# Altium schematic sheet GD_Power_Meter_1.SchDoc: TOP
size A3; PCB PN: PB10013; PCBA PN: PA00013
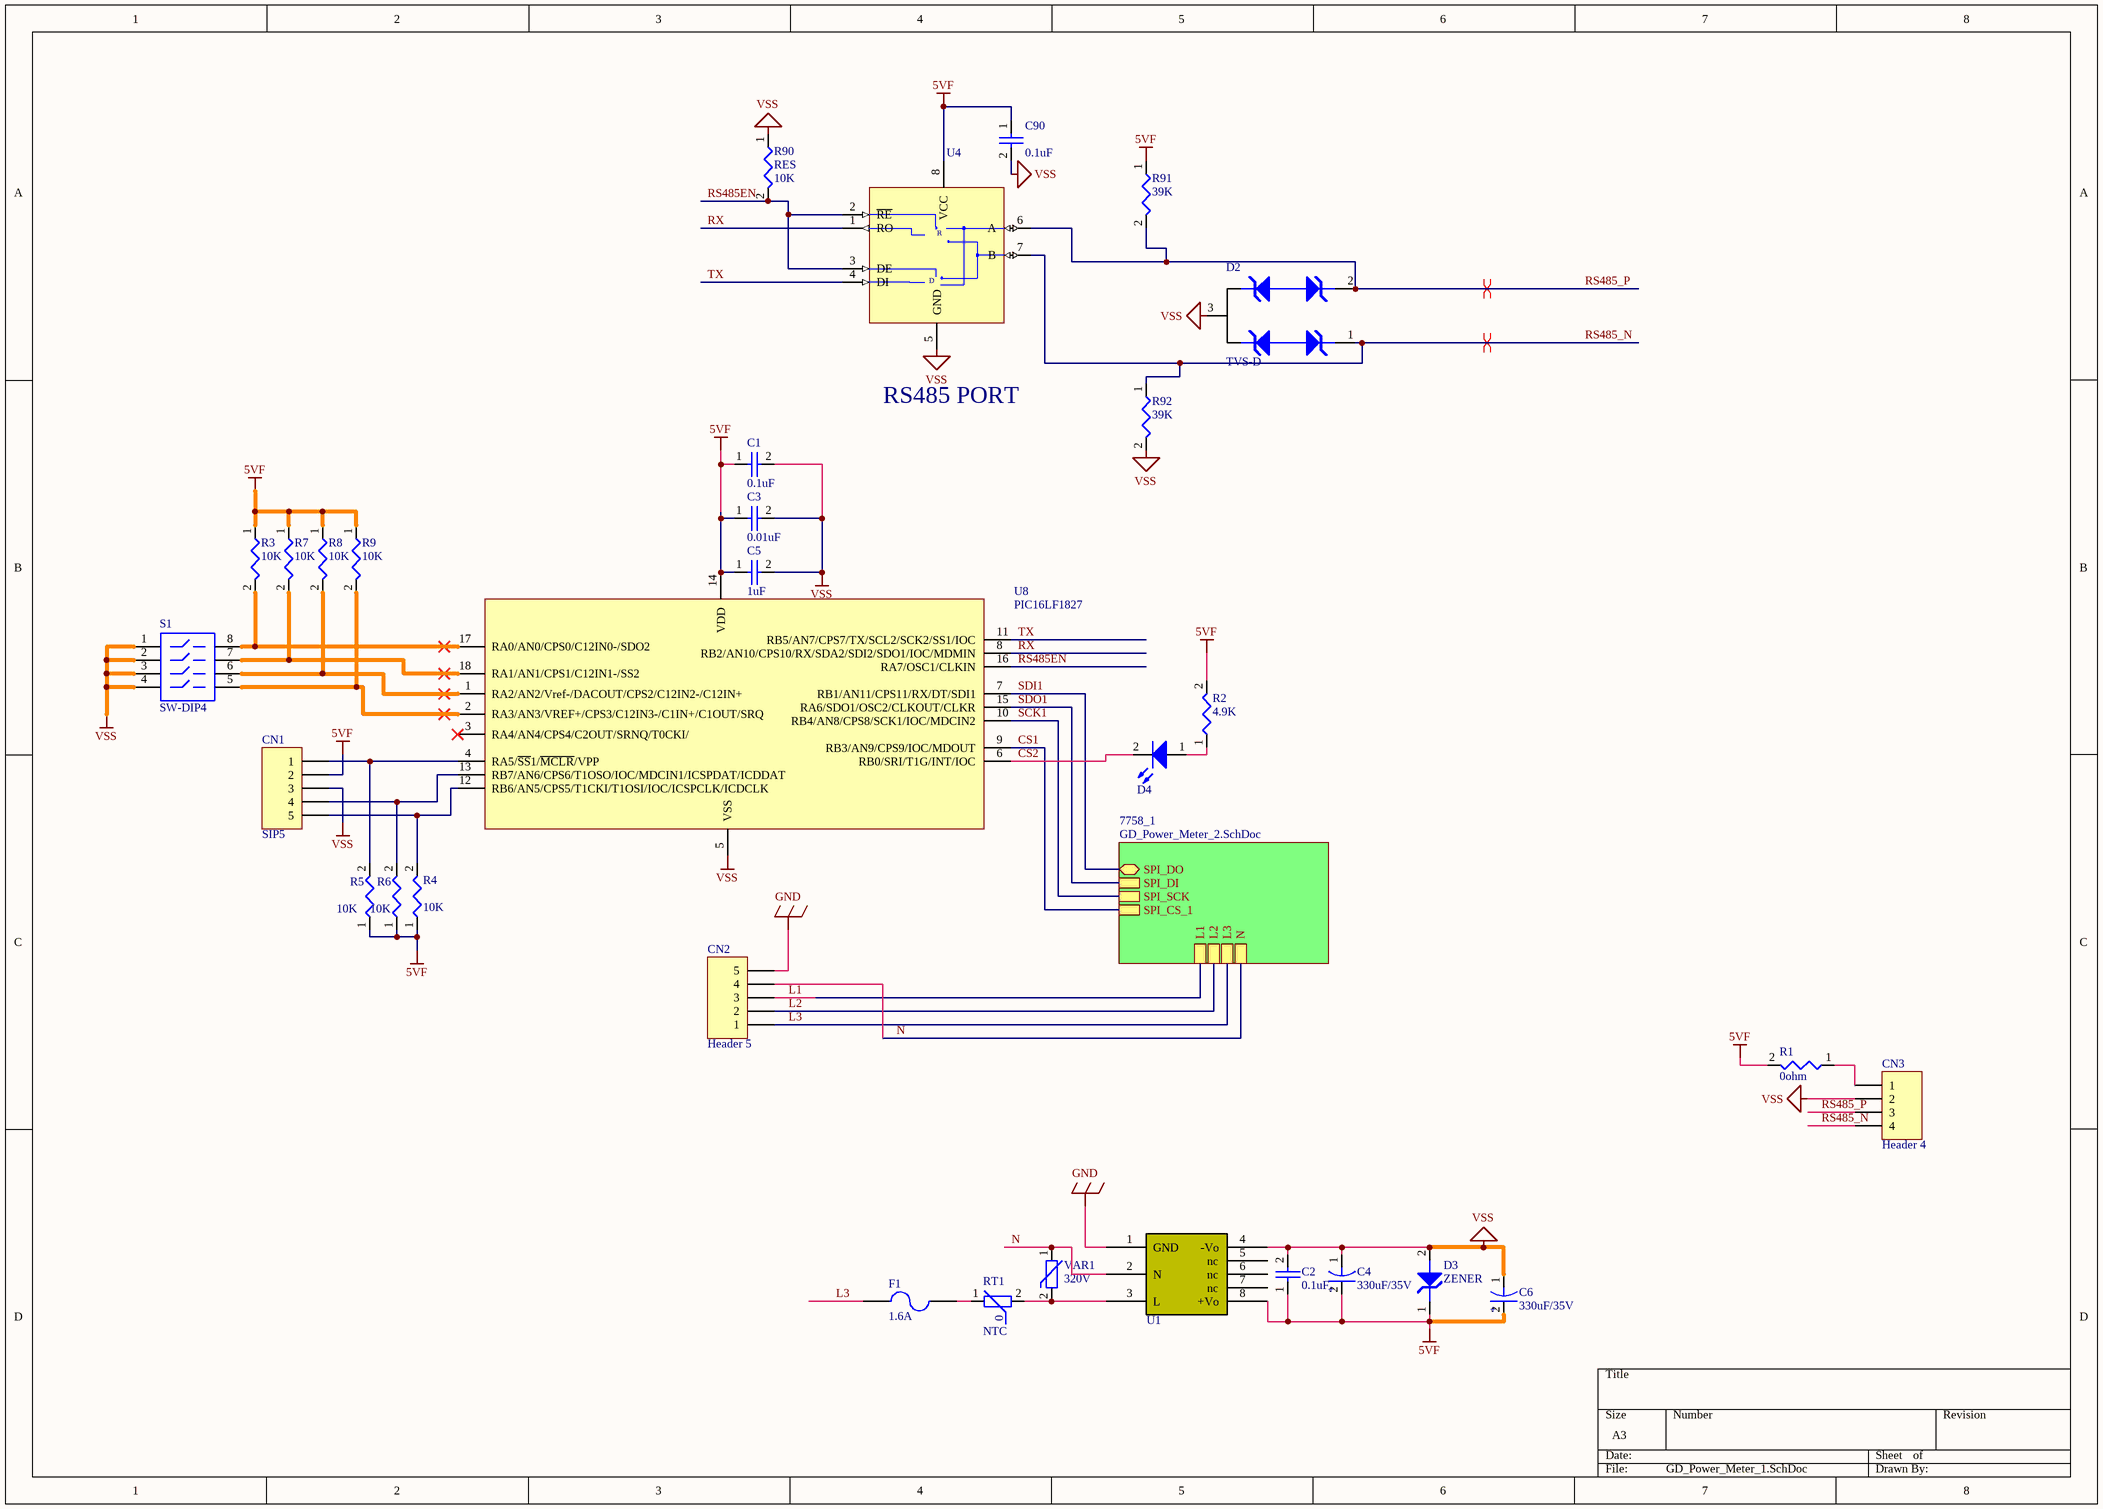
[diagram p0: GD_Power_Meter_1.SchDoc]

## Parts
C1  value 0.1uF  [C0805]  (hidden comment: CAP)
C2  value 0.1uF  [C0805]  (hidden comment: CAP)
C3  value 0.01uF  [C0805]  (hidden comment: CAP)
C4  value 330uF/35V  [CA10X16P5]  (hidden comment: CAPACITOR)
C5  value 1uF  [C0805]  (hidden comment: CAP)
C6  value 330uF/35V  [CA10X16P5]  (hidden comment: CAPACITOR)
C90  value 0.1uF  [C0805]  (hidden comment: CAP)
CN1  SIP5  [SIP5]  (no BOM)
CN2  Header 5  [KF7.62-5P]
CN3  Header 4  [HT5.08-4P-H]
D2  TVS-D  [SOT23-123]
D3  ZENER  [SMB]
D4  ED00056  [LED_DIP]  (value not drawn)
F1  value 1.6A  [392XXXX000]  (hidden comment: Fuse)
R1  value 0ohm  [R0805]  (hidden comment: RES)
R2  value 4.9K  [R0805]  (hidden comment: RES)
R3  value 10K  [R0603]  (hidden comment: RES)
R4  value 10K  [R0603]  (hidden comment: RES)
R5  value 10K  [R0603]  (hidden comment: RES)
R6  value 10K  [R0603]  (hidden comment: RES)
R7  value 10K  [R0603]  (hidden comment: RES)
R8  value 10K  [R0603]  (hidden comment: RES)
R9  value 10K  [R0603]  (hidden comment: RES)
R90  RES  value 10K  [R0603]
R91  value 39K  [R0805]  (hidden comment: RES)  (no BOM)
R92  value 39K  [R0805]  (hidden comment: RES)  (no BOM)
RT1  NTC  [NTC8_5x6P5]
S1  SW-DIP4  [SW_4P]
U1  LH05-10B05  [LH05X]  (value not drawn)
U4  SN65HVD11D  [SOIC8]  (value not drawn)
U8  PIC16LF1827  [SO18]
VAR1  value 320V  [VAR16_7X6_6P7_5]  (hidden comment: VARISTOR)

## Sub-sheets
7758_1 = GD_Power_Meter_2.SchDoc: L2, L3, L1, SPI_DI, SPI_DO (bidir), SPI_SCK, SPI_CS_1, N

## Nets
5VF: C1.1 C2.1 C3.1 C4.2 C5.1 C6.2 C90.1 CN1.2 D3.1 R1.2 R2.2 R3.1 R4.1 R5.1 R6.1 R7.1 R8.1 R9.1 R91.1 U1.8(+Vo) U4.8(VCC) U8.14(VDD)
GND: CN2.5 U1.1(GND)
VSS: C1.2 C2.2 C3.2 C4.1 C5.2 C6.1 C90.2 CN1.3 CN3.2 D2.3 D3.2 R90.1 R92.2 S1.1 S1.2 S1.3 S1.4 U1.4(-Vo) U4.5(GND) U8.5(VSS)
CS1: U8.9(RB3/AN9/CPS9/IOC/MDOUT) ; sheet 7758_1/SPI_CS_1
CS2: D4.2 U8.6(RB0/SRI/T1G/INT/IOC)
L1: CN2.3 ; sheet 7758_1/L1
L2: CN2.2 ; sheet 7758_1/L2
L3: CN2.1 F1.1 ; sheet 7758_1/L3
N: CN2.4 U1.2(N) VAR1.1 ; sheet 7758_1/N
RS485_N: CN3.4 D2.1 R92.1 U4.7(B)
RS485_P: CN3.3 D2.2 R91.2 U4.6(A)
RS485EN: R90.2 U4.2(~{RE}) U4.3(DE) U8.16(RA7/OSC1/CLKIN)
RX: U4.1(RO) U8.8(RB2/AN10/CPS10/RX/SDA2/SDI2/SDO1/IOC/MDMIN)
SCK1: U8.10(RB4/AN8/CPS8/SCK1/IOC/MDCIN2) ; sheet 7758_1/SPI_SCK
SDI1: U8.7(RB1/AN11/CPS11/RX/DT/SDI1) ; sheet 7758_1/SPI_DO
SDO1: U8.15(RA6/SDO1/OSC2/CLKOUT/CLKR) ; sheet 7758_1/SPI_DI
TX: U4.4(DI) U8.11(RB5/AN7/CPS7/TX/SCL2/SCK2/SS1/IOC)
NetCN1_1: CN1.1 R5.2 U8.4(RA5/~{SS}1/~{MCLR}/VPP)
NetCN1_4: CN1.4 R6.2 U8.13(RB7/AN6/CPS6/T1OSO/IOC/MDCIN1/ICSPDAT/ICDDAT)
NetCN1_5: CN1.5 R4.2 U8.12(RB6/AN5/CPS5/T1CKI/T1OSI/IOC/ICSPCLK/ICDCLK)
NetCN3_1: CN3.1 R1.1
NetD4_1: D4.1 R2.1
NetF1_2: F1.2 RT1.1
NetR3_2: R3.2 S1.8 U8.17(RA0/AN0/CPS0/C12IN0-/SDO2)
NetR7_2: R7.2 S1.7 U8.18(RA1/AN1/CPS1/C12IN1-/SS2)
NetR8_2: R8.2 S1.6 U8.1(RA2/AN2/Vref-/DACOUT/CPS2/C12IN2-/C12IN+)
NetR9_2: R9.2 S1.5 U8.2(RA3/AN3/VREF+/CPS3/C12IN3-/C1IN+/C1OUT/SRQ)
NetRT1_2: RT1.2 U1.3(L) VAR1.2

Not connected (* = marked no-connect by the designer): U1 5(nc) 6(nc) 7(nc); U8 3(RA4/AN4/CPS4/C2OUT/SRNQ/T0CKI/)*

## Layout directives
differential pair: RS485_N, RS485_P

## Notes on the sheet
- RS485 PORT
- (in symbol EC00095) +
- (in symbol EF00003) 0
- (in symbol EU00041) R; D

## Library data of the parts
C1 C2 C90 = EC00014: CAP SMD CR X7R 50V 10% 0.1uF 0805 ROHS; Manufacturer: YAGEO; Manufacturer P/N: CC0805KRX7R9BB104; ID: 14; HelpURL: *; P/N: EC00014
C3 = EC00018: CAP SMD CR X7R 50V 10% 10nF 0805 ROHS; Manufacturer: Murata; Manufacturer P/N: GRM216R71H103KA01D; ID: 18; HelpURL: *; P/N: EC00018
C4 C6 = EC00095: CAP 35V 20% 330uF 10X16X0.6MM ROHS，7000hours; Manufacturer: NIPPON CHEMI-CON; Manufacturer P/N: EKY350ELL331MJ16S; ID: 95; Type: ****; HelpURL: \\192.168.1.3\Esh\Department\RD\CAD\Component\Capacitor\KY(105).pdf; P/N: EC00095
C5 = EC00002: CAP SMD CR X7R 50V 10% 1uF 0805 ROHS; Manufacturer: YAGEO; Manufacturer P/N: CC0805KKX7R9BB105; ID: 2; HelpURL: *; P/N: EC00002
CN1 = EJ00017: CONNECTOR 5PIN,2.54PITCH,SIP-5; Manufacturer: 信荣; Manufacturer P/N: PH2.54*1*5*11.6/3.0; ID: 17; P/N: EJ00017; Value: SIP-5
CN2 = Header 5: Header, 5-Pin , 2p+ 3p; P/N: EE00006; Manufacturer: *; Manufacturer P/N: KF7.62-5P
CN3 = Header 4: Header, 4-Pin; Manufacturer P/N: HT5.08-4 Bend; P/N: EE00005; Manufacturer: *
D2 = ED00007: DIODE TVS 7V 12V 17A 400W SOT-23 SMD ROHS; Manufacturer: BOURNS; ID: 7; Value: CDSOT23-SM712; Type: ****; HelpURL: \\192.168.1.3\Esh\Department\RD\CAD\Component\IO_PROTECTION\BOURNS_CDSOT23-SM712.pdf; P/N: ED00007; Manufacturer P/N: CDSOT23-SM712
D3 = ED00032: Manufacturer P/N: SMBJ7.0A; Manufacturer: Bourns; P/N: EE00002; Value: SMBJ7.0A; Type: ****
D4 = ED00056: 3.0mm Round Type LED Lamps Yellow/Green; Manufacturer P/N: 1224-10SYGC/S530-E2; Manufacturer: EVERLIGHT; ID: 56; Value: 1224-10SYGC/S530-E2; P/N: ED00056
F1 = EF00005: FUSE,Ceramic,1.6A,25A@250VAC,8.5x8mm,ROHS; Manufacturer: LITTELFUSE; Manufacturer P/N: 39211600440; ID: 5; Type: ****; HelpURL: \\192.168.1.3\Esh\Department\RD\CAD\Component\Fuse\Ltitelfuse_Fuse_392.pdf; P/N: EF00005
R1 = ER00026: RES THICK_FILM SMD 0 OHM 5% 1/8W ROHS 0805; Manufacturer: YAGEO; Manufacturer P/N: RC0805JR-070RL; ID: 26; HelpURL: *; P/N: ER00026
R2 = ER00028: Manufacturer: YAGEO; P/N: EE00008
R3-R9 R90 = ER00213: RES THICK_FILM SMD 10K ohm 5% 1/10W ROHS 0603; Manufacturer: YAGEO; Manufacturer P/N: RC0603JR-1310KL; ID: 213; HelpURL: \\192.168.1.3\Esh\Department\RD\CAD\Component\Resistor\SMD\YAGEO_PYu-RC1206_51_RoHS_L_4.pdf; P/N: ER00213
R91 R92 = ER00021: RES THICK_FILM SMD 39K 5% 1/8W ROHS 0805; Manufacturer: YAGEO; Manufacturer P/N: RC0805JR-0739KL; ID: 21; HelpURL: *; P/N: ER00021
RT1 = EF00003: Manufacturer P/N: 5D2-08LD; Manufacturer: SEMITEC; P/N: EE00003; Value: 5 Ohm  3A
S1 = SW-DIP4: 侧拨 4位; Manufacturer: WE; Manufacturer P/N: 418317270904; P/N: EE00004; Published: 24-Mar-1999; LatestRevisionDate: 17-Jul-2002; LatestRevisionNote: Re-released for DXP Platform.; PackageReference: DIP-8; Publisher: Altium Limited
U1 = LH05-10B05: Manufacturer: Mornsun; P/N: EE00001; Manufacturer P/N: LH05-10B05
U4 = EU00041: IC 5V,RS-485,10Mbps,16KV,TRANSCEIVERS,SOIC-8,ROHS; Manufacturer P/N: SN65HVD08D; Manufacturer: Texas Instruments; ID: 41; Value: SN65HVD08D; HelpURL: \\192.168.1.3\Esh\Department\RD\CAD\Component\RS485\sn65hvd08.pdf; P/N: EU00041; Type: *****
U8 = EU00033: IC 8-bit UART SPI I2C,SOIC18-W,SMD,ROHS; Manufacturer P/N: PIC16F1827-I/SO; Manufacturer: Microchip; ID: 33; Value: PIC16F1827-I/SO; HelpURL: \\192.168.1.3\Esh\Department\RD\CAD\Component\MCU\PIC16F1827.pdf; P/N: EU00033; Type: *****
VAR1 = ER00200: MOV 320V 14MM 80J LDFR ROHS; Manufacturer: LITTELFUSE; Manufacturer P/N: V320LA20AP; ID: 200; HelpURL: \\192.168.1.3\Esh\Department\RD\CAD\Component\Resistor\Varistor\Littelfuse_MOV_LA.pdf; P/N: ER00200; Type: ****